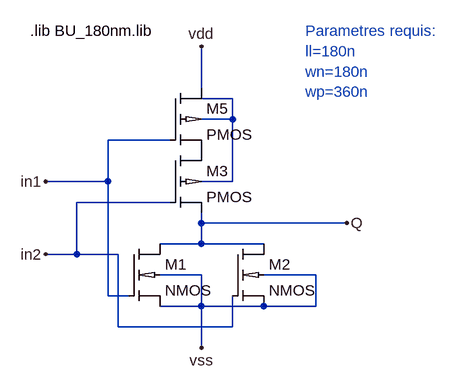
[diagram p0: schematic nor.asc]
nor.asc, the LTspice schematic file:
Version 4
SHEET 1 1192 776
WIRE 416 288 416 224
WIRE 464 304 416 304
WIRE 464 336 464 304
WIRE 464 336 416 336
WIRE 368 368 272 368
WIRE 272 432 272 368
WIRE 272 432 176 432
WIRE 464 432 464 336
WIRE 464 432 416 432
WIRE 368 464 224 464
WIRE 416 496 416 480
WIRE 640 496 416 496
WIRE 416 528 416 496
WIRE 416 528 352 528
WIRE 512 528 416 528
WIRE 224 544 224 464
WIRE 224 544 176 544
WIRE 288 544 224 544
WIRE 416 576 352 576
WIRE 592 576 512 576
WIRE 272 608 272 432
WIRE 304 608 272 608
WIRE 416 624 416 576
WIRE 416 624 352 624
WIRE 512 624 416 624
WIRE 592 624 592 576
WIRE 592 624 512 624
WIRE 288 656 288 544
WIRE 464 656 464 608
WIRE 464 656 288 656
WIRE 416 688 416 624
FLAG 416 224 vdd
FLAG 416 688 vss
FLAG 640 496 Q
FLAG 176 432 in1
FLAG 176 544 in2
SYMBOL pmos018 368 288 R0
SYMATTR InstName M5
SYMATTR Value2 l={ll} w={wp} ad={450n*{wp}} as={450n*{wp}} pd={900n+{wp}} ps={1080n+{wp}}
SYMBOL nmos018 304 528 R0
SYMATTR InstName M1
SYMATTR Value2 l={ll} w={wn} ad={450n*{wn}} as={450n*{wn}} pd={900n+{wn}} ps={1080n+{wn}}
SYMBOL pmos018 368 384 R0
SYMATTR InstName M3
SYMATTR Value2 l={ll} w={wp} ad={450n*{wp}} as={450n*{wp}} pd={900n+{wp}} ps={1080n+{wp}}
SYMBOL nmos018 464 528 R0
SYMATTR InstName M2
SYMATTR Value2 l={ll} w={wn} ad={450n*{wn}} as={450n*{wn}} pd={900n+{wn}} ps={1080n+{wn}}
TEXT 152 200 Left 2 !.lib BU_180nm.lib
TEXT 576 200 Left 2 ;Parametres requis: \nll=180n \nwn=180n \nwp=360n

The netlist it stands for:
* nor.asc
M5 vdd in1 P001 N001 PMOS l={ll} w={wp} ad={450n*{wp}} as={450n*{wp}} pd={900n+{wp}} ps={1080n+{wp}}
M1 Q in1 vss vss NMOS l={ll} w={wn} ad={450n*{wn}} as={450n*{wn}} pd={900n+{wn}} ps={1080n+{wn}}
M3 P001 in2 Q N001 PMOS l={ll} w={wp} ad={450n*{wp}} as={450n*{wp}} pd={900n+{wp}} ps={1080n+{wp}}
M2 Q in2 vss vss NMOS l={ll} w={wn} ad={450n*{wn}} as={450n*{wn}} pd={900n+{wn}} ps={1080n+{wn}}
.model NMOS NMOS
.model PMOS PMOS
.lib standard.mos
.lib BU_180nm.lib
* Parametres requis:
* ll=180n
* wn=180n
* wp=360n
.lib BU_180nm.lib
.backanno
.end